# EasyEDA schematic PULSE-CONVERTER.json

## Sheets
1 Sheet_1: TITLE: Sheet_1; REV: 1.0; Date: 2025-03-14; Sheet: 1/1; Company: WASH-PRO
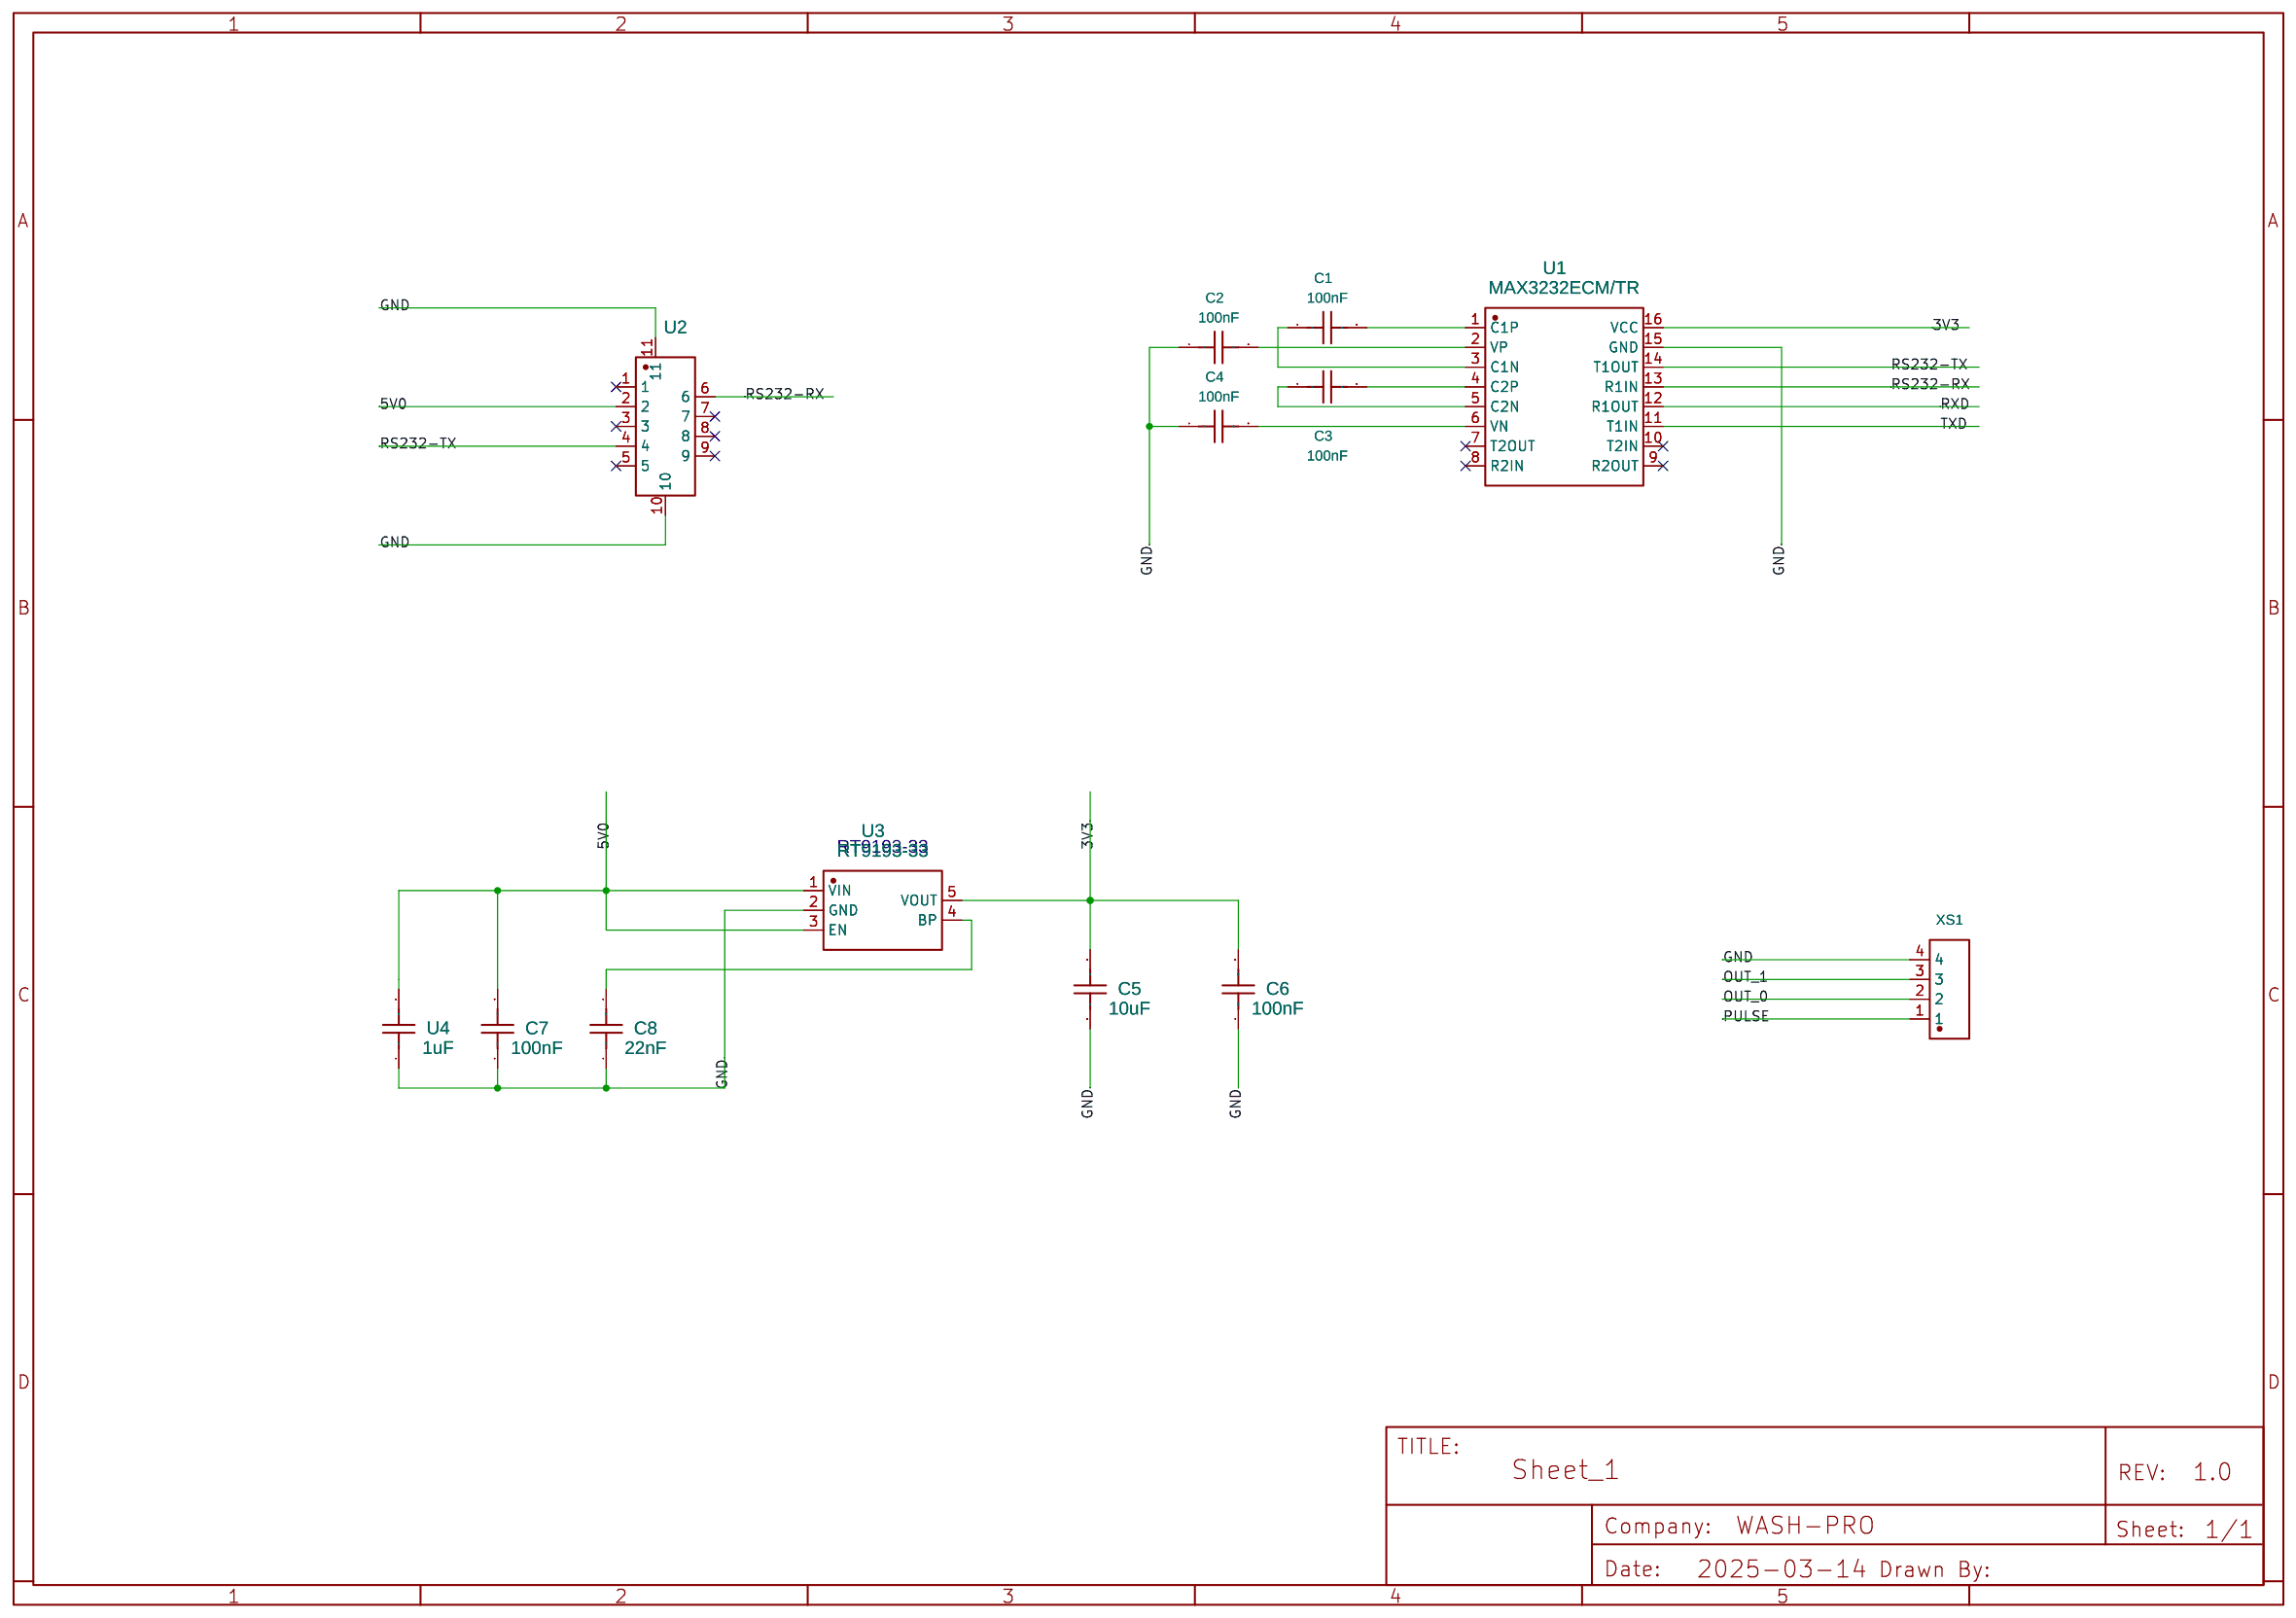
[diagram p0: Sheet_1]
2 Sheet_2
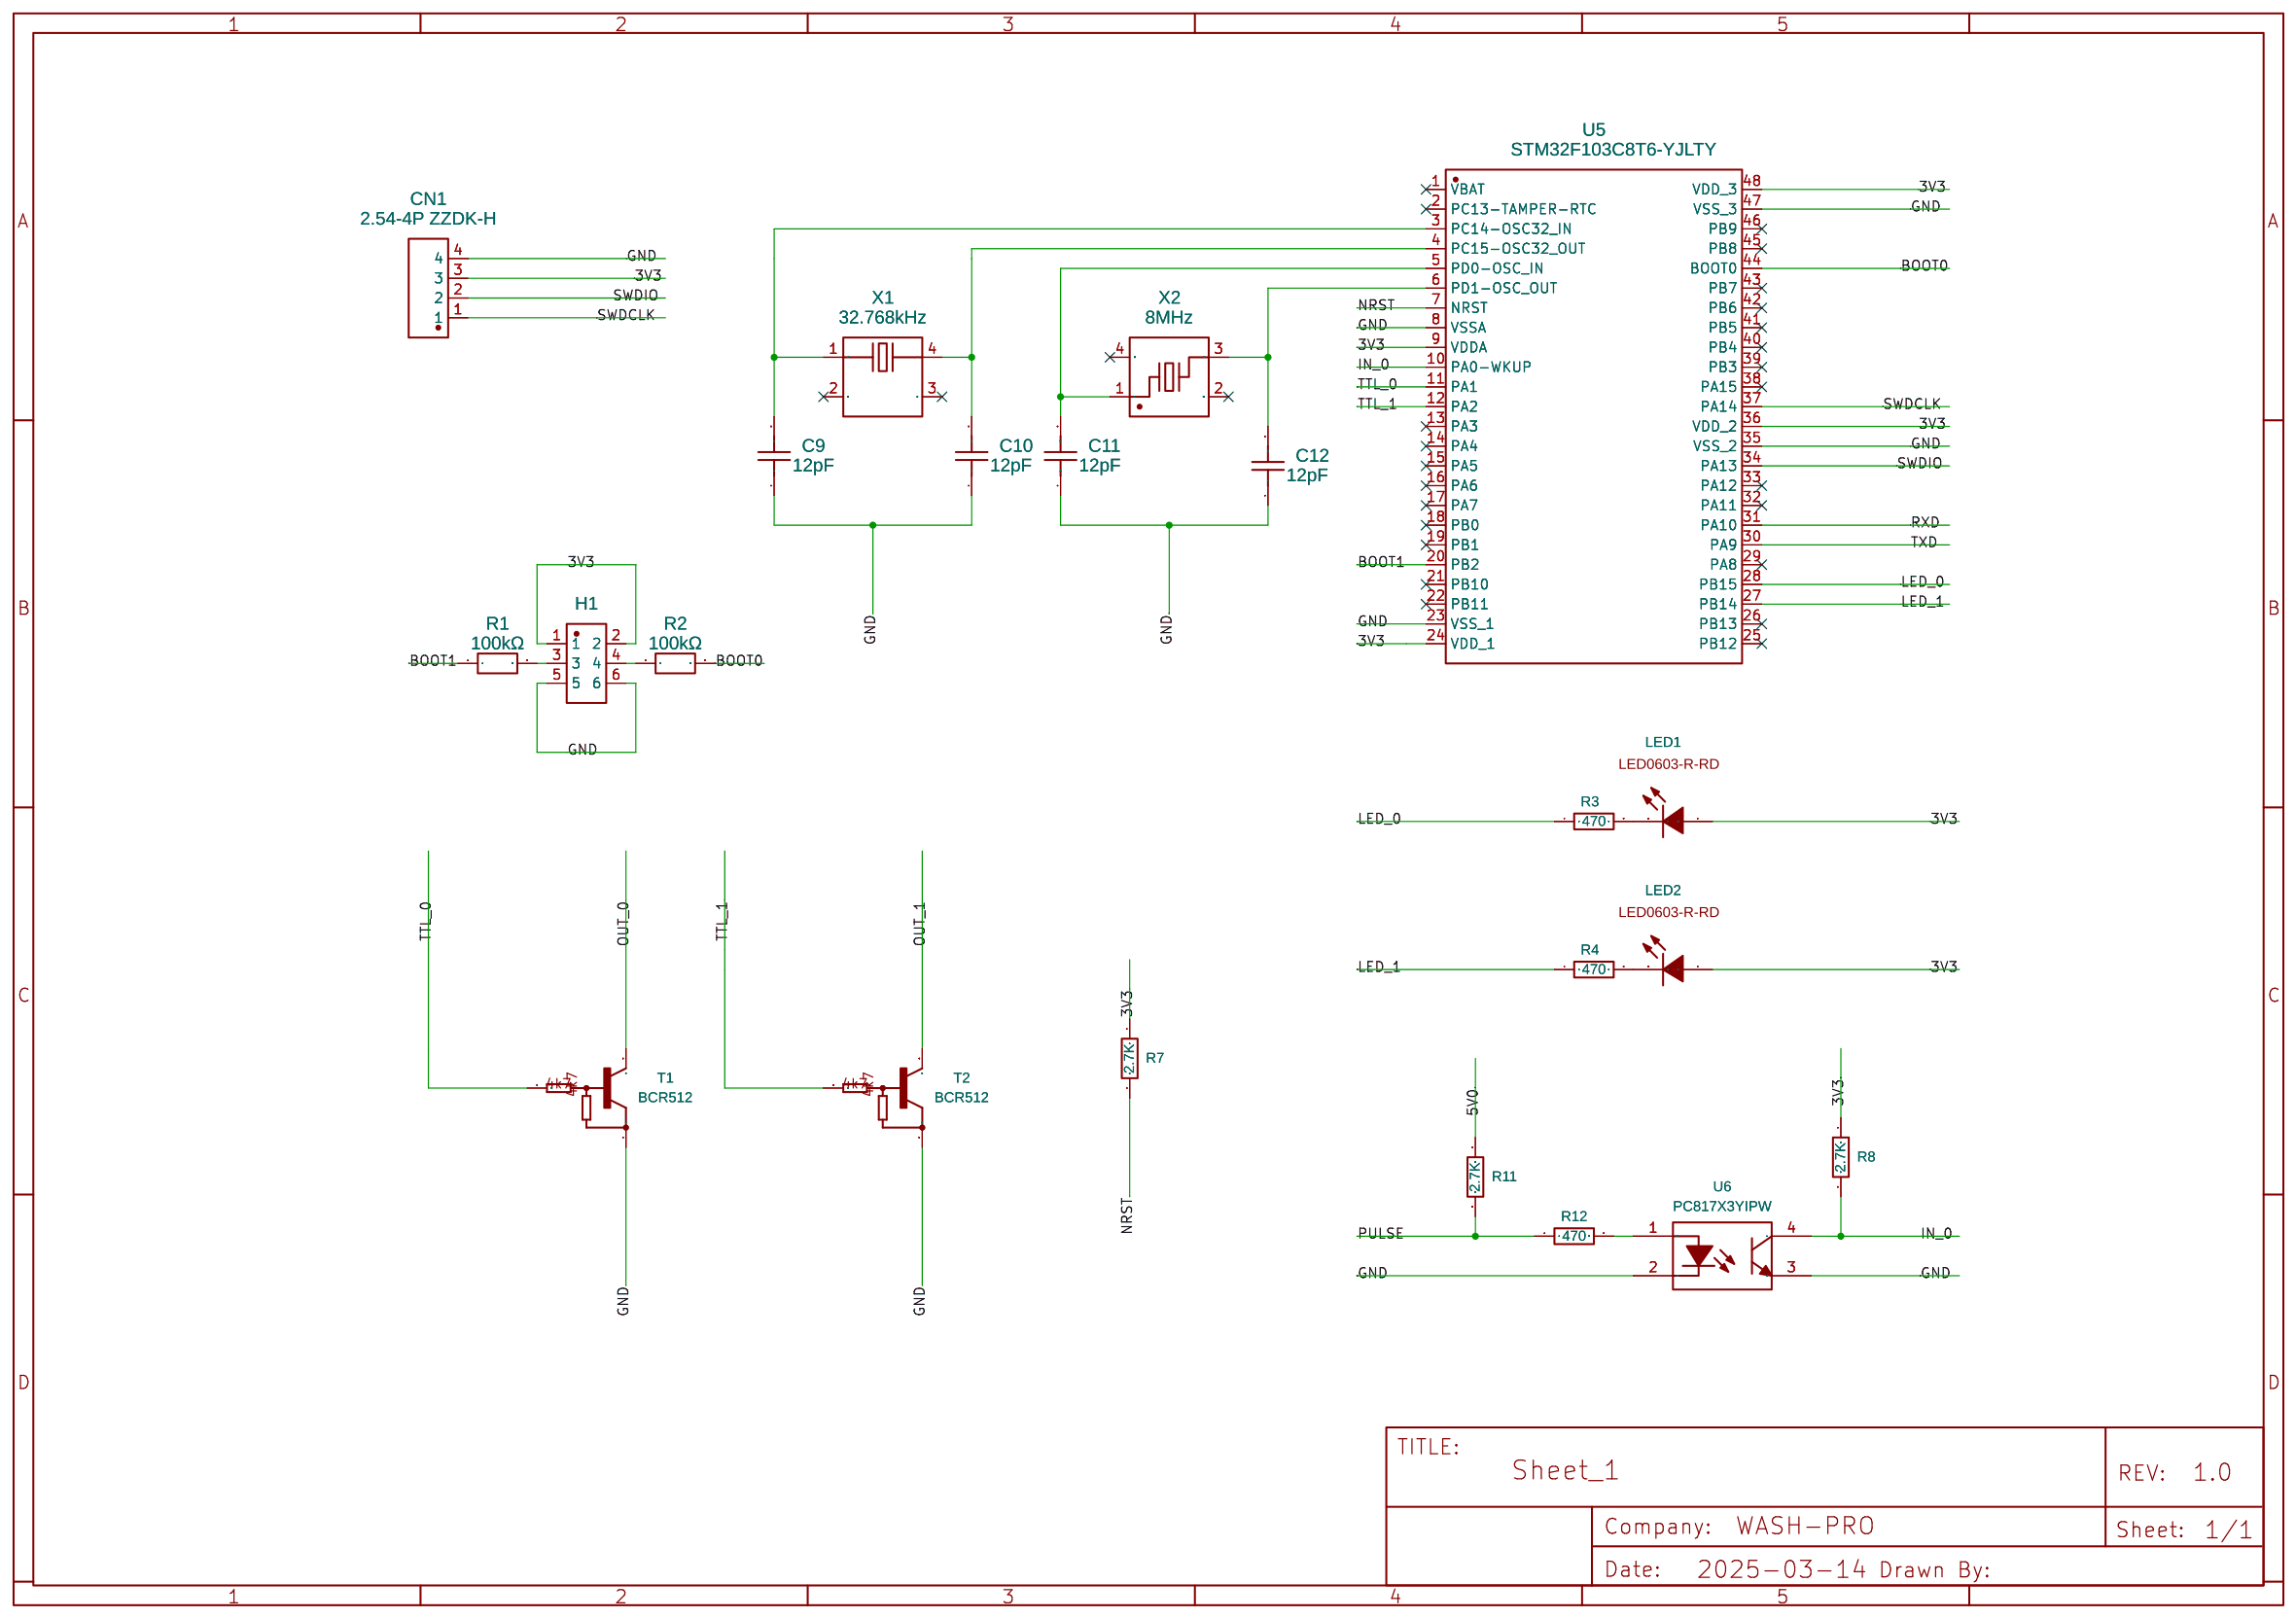
[diagram p1: Sheet_2]

## Parts
sheet Sheet_1
C1  100nF  [C0805]
C2  100nF  [C0805]
C3  100nF  [C0805]
C4  100nF  [C0805]
C5  10uF  [C0805]
C6  100nF  [C0603]
C7  100nF  [C0603]
C8  22nF  [C0603]
U1  MAX3232ECM/TR  [SOP-16_L9.9-W3.9-P1.27-LS6.1-BL]
U2  618009211821  [DB9-TH_DB9F]
U3  RT9193-33  [SOT-23-5_L2.9-W1.6-P0.95-LS2.8-BL]
U4  1uF  [C0805]
XS1  XY2500V-E-3.81-4P  [CONN-TH_XY2500V-E-3.81-4P]
sheet Sheet_2
C9  12pF  [C0603]
C10  12pF  [C0603]
C11  12pF  [C0603]
C12  12pF  [C0603]
CN1  2.54-4P ZZDK-H  [CONN-TH_2.54-4P-ZZDK-H]
H1  2.54-2*3  [HDR-TH_6P-P2.54-V-R2-C3-S2.54_A2541WV-2X3P]
LED1  19-217/BHC-XL2M2TY/3T  [LED0603-R-RD]
LED2  19-217/BHC-XL2M2TY/3T  [LED0603-R-RD]
R1  100kΩ  [R0603]
R2  100kΩ  [R0603]
R3  470  [R0603]
R4  470  [R0603]
R7  2.7K  [R0603]
R8  2.7K  [R0603]
R11  2.7K  [R0603]
R12  470  [R0603]
T1  BCR512  [SOT23-R_INFINEON]
T2  BCR512  [SOT23-R_INFINEON]
U5  STM32F103C8T6-YJLTY  [QFP-48_L7.0-W7.0-P0.50-LS9.0-BL]
U6  PC817X3YIPW  [OPTO-SMD-4_L6.5-W4.6-P2.54-LS10.0-TL]
X1  32.768kHz  [CRYSTAL-SMD_L8.0-W3.2-P5.50-LS3.8-BL]
X2  8MHz  [OSC-SMD_4P-L3.2-W2.5-BL-OXETDLJANF-0.032768MHZ]

## Library data of the parts
C1-C4 = CL21B104KACNFNC: Supplier: LCSC; Supplier Part: C913935; Manufacturer: SAMSUNG(三星); JLCPCB Part Class: Extended Part; Contributor: LCSC; Package Display: No
C5 = CGA4J1X7R0J106M125AD: Contributor: lcsc; Supplier: LCSC; Supplier Part: C3840859; Manufacturer: TDK; Package Display: No
C6 C7 = C1608X5R1H104K080AA: Supplier: LCSC; Supplier Part: C3846795; Manufacturer: TDK; Contributor: lcsc; JLCPCB Part Class: Extended Part; Package Display: No
C8 = C1608X7R2A223K080AE_C3843204: Contributor: lcsc; Supplier: LCSC; Supplier Part: C3843204; Manufacturer: TDK; Manufacturer Part: C1608X7R2A223K080AE; Package Display: No
U1 = MAX3232ECM/TR: Contributor: lcsc; Supplier: LCSC; Supplier Part: C5310894; Manufacturer: HGSEMI(华冠); JLCPCB Part Class: Extended Part; Package Display: No
U2 = 618009211821: Supplier: LCSC; Supplier Part: C17538281; Manufacturer: Wurth(伍尔特); Contributor: lcsc; JLCPCB Part Class: Extended Part; Package Display: No
U3 = RT9193-33: Contributor: lcsc; Supplier: LCSC; Supplier Part: C9900015455; Manufacturer: null; JLCPCB Part Class: Extended Part; Package Display: No
U4 = C2012X5R1C105M085AA: Contributor: lcsc; Supplier: LCSC; Supplier Part: C3875014; Manufacturer: TDK; Package Display: No
XS1 = XY2500V-E-3.81-4P: Supplier: LCSC; Supplier Part: C880565; Manufacturer: XINLAIYA(新莱亚); Contributor: LCSC; JLCPCB Part Class: Extended Part; Package Display: No
C9-C12 = C1608NP01H120J080AA: Contributor: lcsc; Supplier: LCSC; Supplier Part: C3866562; Manufacturer: TDK; JLCPCB Part Class: Extended Part; Package Display: No
CN1 = 2.54-4P ZZDK-H: Supplier: LCSC; Supplier Part: C49023800; Manufacturer: SHOU HAN(首韩); JLCPCB Part Class: Extended Part; Contributor: lcsc; Package Display: No
H1 = 2.54-2*3: Supplier: LCSC; Supplier Part: C5116479; Manufacturer: ZHOURI(洲日); JLCPCB Part Class: Extended Part; Contributor: lcsc; Package Display: No
LED1 LED2 = 19-217/BHC-XL2M2TY/3T: Supplier: LCSC; Supplier Part: C264464; Manufacturer: Everlight Elec; Contributor: LCSC; JLCPCB Part Class: Extended Part; Package Display: Yes
R1 R2 = RHS-03K1003FT: Supplier: LCSC; Supplier Part: C5355232; Manufacturer: FH(风华); JLCPCB Part Class: Extended Part; Contributor: lcsc; Package Display: No
R3 R4 R12 = RC0603JR-07470RL: Supplier: LCSC; Manufacturer: YAGEO; Supplier Part: C114433; JLCPCB Part Class: Extended Part; Resistance: 470Ω; Package Display: No
R7 R8 R11 = MCR03ERTF1241: Supplier: LCSC; Supplier Part: C308035; Manufacturer: ROHM Semicon; Resistance (Ohms): 1.24K; Contributor: LCSC; JLCPCB Part Class: Extended Part; Package Display: No
T1 T2 = BCR512: Package Display: No
U5 = STM32F103C8T6-YJLTY: Contributor: LCSC; Supplier: LCSC; Supplier Part: C2911485; Manufacturer: null; JLCPCB Part Class: Extended Part; Package Display: No
U6 = PC817X3YIPW: Supplier: LCSC; Supplier Part: C2833077; Manufacturer: SHARP(夏普); Contributor: LCSC; JLCPCB Part Class: Extended Part; Package Display: No
X1 = XKZEL89CII-112YLC-32.768K: Supplier: LCSC; Supplier Part: C18214298; Manufacturer: YXC(扬兴晶振); Contributor: lcsc; JLCPCB Part Class: Extended Part; Package Display: No
X2 = 7U08000E10UCG: Contributor: LCSC; Supplier: LCSC; Supplier Part: C524714; Manufacturer: SJK(晶科鑫); JLCPCB Part Class: Extended Part; Package Display: No

## Nets
3V3: C5.2 C6.2 CN1.3 H1.1 H1.2 LED1.1(A) LED2.1(A) R7.1 R8.1 U1.16(VCC) U3.5(VOUT) U5.9(VDDA) U5.24(VDD_1) U5.36(VDD_2) U5.48(VDD_3)
5V0: C7.2 R11.1 U2.2 U3.1(VIN) U3.3(EN) U4.2
GND: C2.1 C4.1 C5.1 C6.1 C7.1 C8.1 C9.1 C10.1 C11.1 C12.1 CN1.4 H1.5 H1.6 T1.2(E) T2.2(E) U1.15(GND) U2.10 U2.11 U3.2(GND) U4.1 U5.8(VSSA) U5.23(VSS_1) U5.35(VSS_2) U5.47(VSS_3) U6.2 U6.3 XS1.4
BOOT0: R2.2 U5.44(BOOT0)
BOOT1: R1.1 U5.20(PB2)
IN_0: R8.2 U5.10(PA0-WKUP) U6.4
LED_0: R3.1 U5.28(PB15)
LED_1: R4.1 U5.27(PB14)
NRST: R7.2 U5.7(NRST)
OUT_0: T1.3(C) XS1.2
OUT_1: T2.3(C) XS1.3
PULSE: R11.2 R12.1 XS1.1
RS232-RX: U1.13(R1IN) U2.6
RS232-TX: U1.14(T1OUT) U2.4
RXD: U1.12(R1OUT) U5.31(PA10)
SWDCLK: CN1.1 U5.37(PA14)
SWDIO: CN1.2 U5.34(PA13)
TTL_0: T1.1(B) U5.11(PA1)
TTL_1: T2.1(B) U5.12(PA2)
TXD: U1.11(T1IN) U5.30(PA9)
Net-(C1-1): C1.1 U1.3(C1N)
Net-(C1-2): C1.2 U1.1(C1P)
Net-(C2-2): C2.2 U1.2(VP)
Net-(C3-1): C3.1 U1.5(C2N)
Net-(C3-2): C3.2 U1.4(C2P)
Net-(C4-2): C4.2 U1.6(VN)
Net-(C8-2): C8.2 U3.4(BP)
Net-(C9-2): C9.2 U5.3(PC14-OSC32_IN) X1.1
Net-(C10-2): C10.2 U5.4(PC15-OSC32_OUT) X1.4
Net-(C11-2): C11.2 U5.5(PD0-OSC_IN) X2.1
Net-(C12-2): C12.2 U5.6(PD1-OSC_OUT) X2.3
Net-(H1-3): H1.3 R1.2
Net-(H1-4): H1.4 R2.1
Net-(LED1-2): LED1.2(K) R3.2
Net-(LED2-2): LED2.2(K) R4.2
Net-(R12-2): R12.2 U6.1

Not connected (* = marked no-connect by the designer): U1 7(T2OUT)* 8(R2IN)* 9(R2OUT)* 10(T2IN)*; U2 1* 3* 5* 7* 8* 9*; U5 1(VBAT)* 2(PC13-TAMPER-RTC)* 13(PA3)* 14(PA4)* 15(PA5)* 16(PA6)* 17(PA7)* 18(PB0)* 19(PB1)* 21(PB10)* 22(PB11)* 25(PB12)* 26(PB13)* 29(PA8)* 32(PA11)* 33(PA12)* 38(PA15)* 39(PB3)* 40(PB4)* 41(PB5)* 42(PB6)* 43(PB7)* 45(PB8)* 46(PB9)*; X1 2* 3*; X2 2(GND)* 4(GND)*

## Notes on the sheets
sheet 1
- RT9193-33
